# EAGLE schematic board_0.2v (EAGLE 7.7.0)
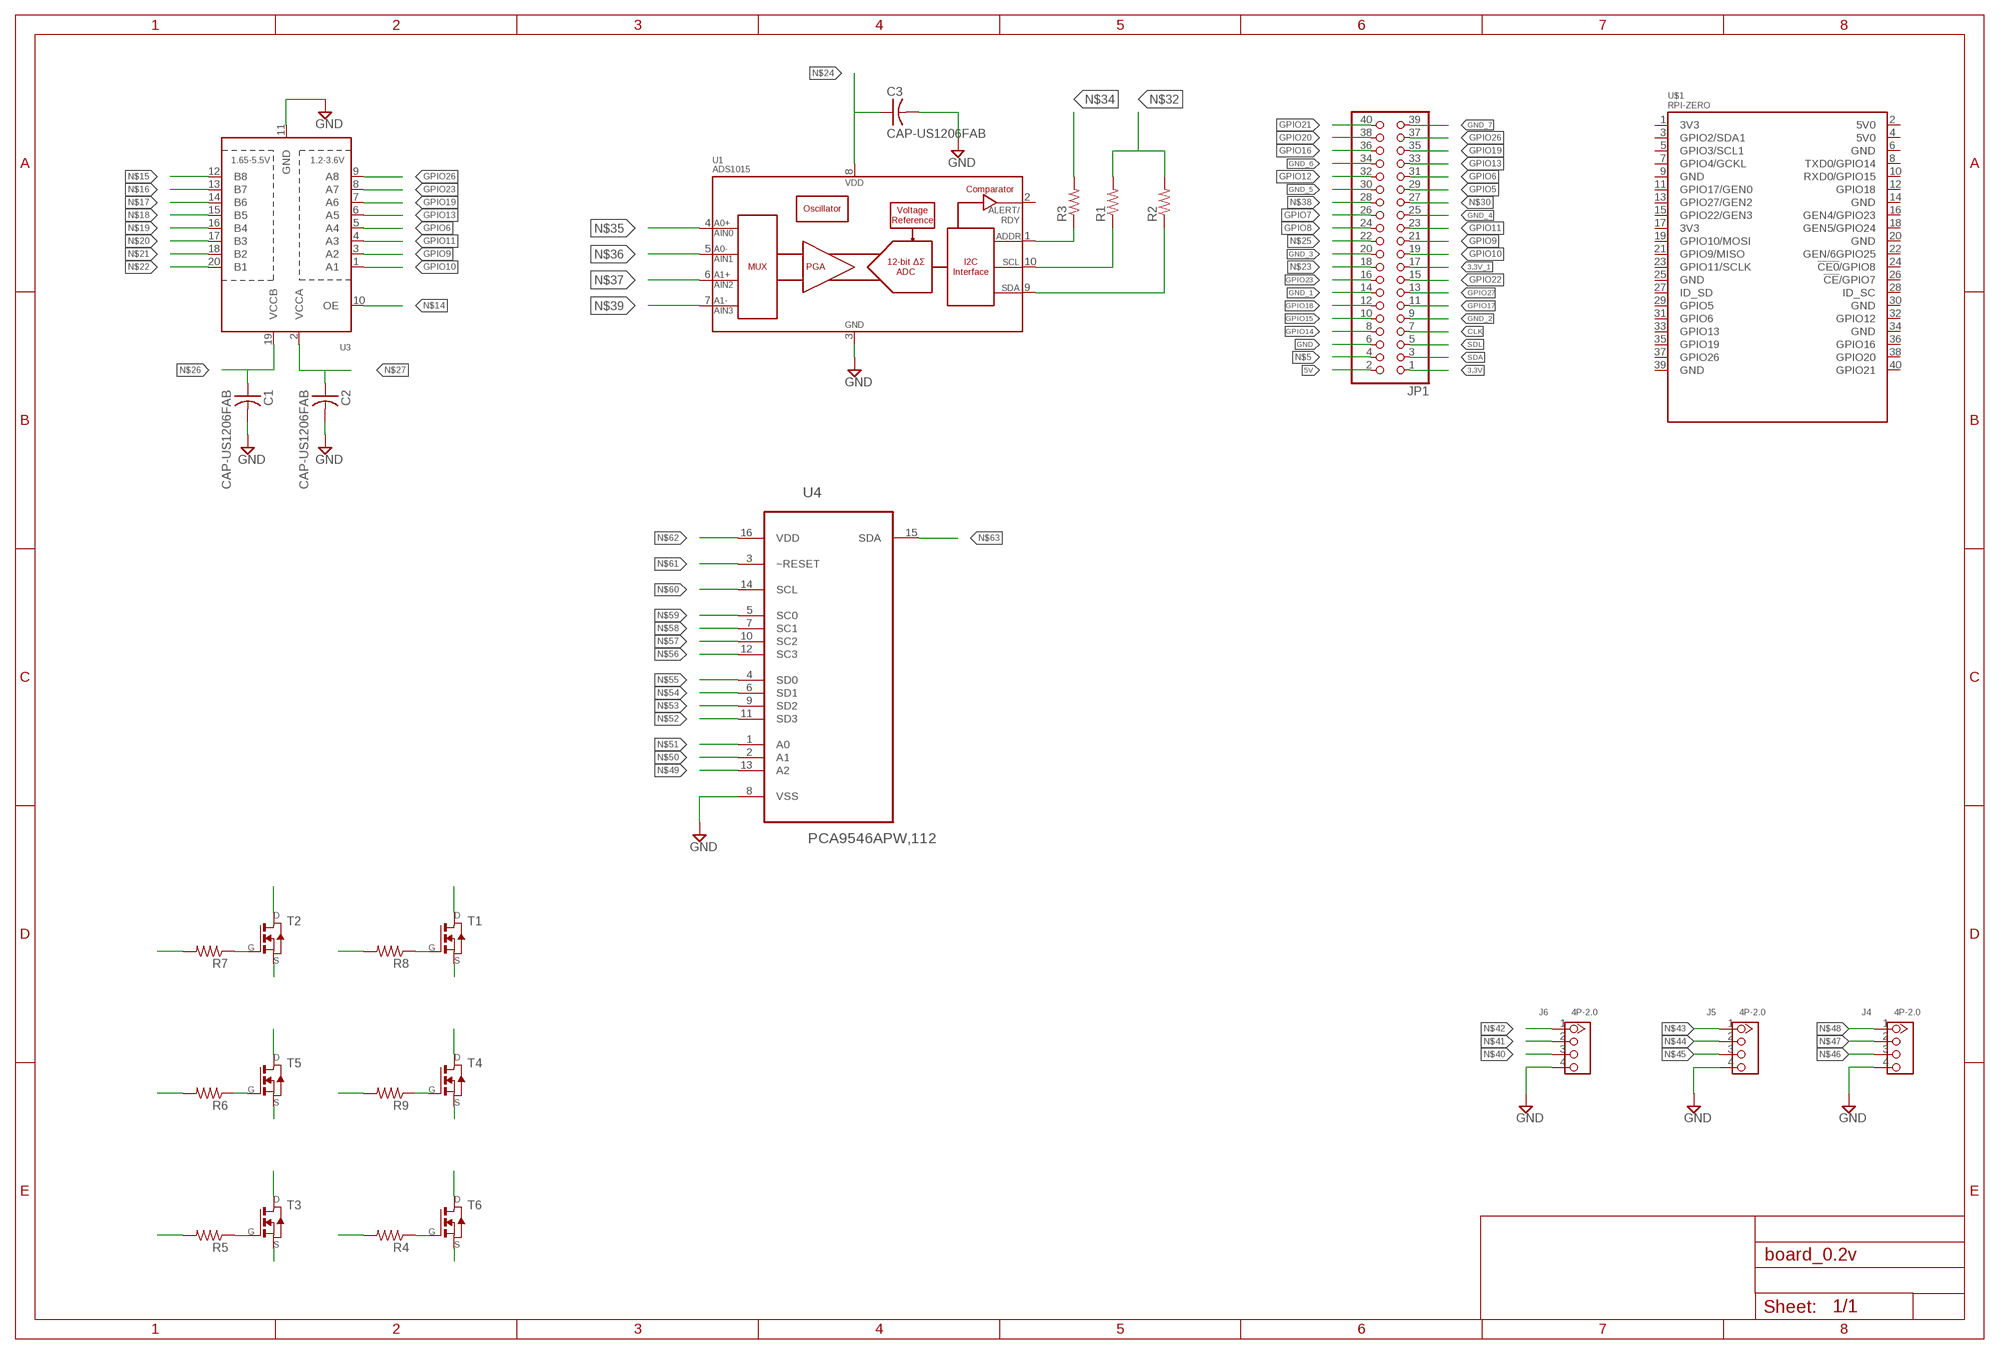
[diagram p0: schematic, sheet 1]

## Parts
C1  CAP-US1206FAB  [C1206FAB]
C2  CAP-US1206FAB  [C1206FAB]
C3  CAP-US1206FAB  [C1206FAB]
J4  4P-2.0  GROVE-CONNECTOR-DIP(4P-2.0)  [HW4-2.0]
J5  4P-2.0  GROVE-CONNECTOR-DIP(4P-2.0)  [HW4-2.0]
J6  4P-2.0  GROVE-CONNECTOR-DIP(4P-2.0)  [HW4-2.0]
JP1  PINHD-2X20  [2X20]
R1  RES-US1206FAB  [R1206FAB]
R2  RES-US1206FAB  [R1206FAB]
R3  RES-US1206FAB  [R1206FAB]
R4  RES-US1206FAB  [R1206FAB]
R5  RES-US1206FAB  [R1206FAB]
R6  RES-US1206FAB  [R1206FAB]
R7  RES-US1206FAB  [R1206FAB]
R8  RES-US1206FAB  [R1206FAB]
R9  RES-US1206FAB  [R1206FAB]
T1  NMOSFETTO252  [TO252]
T2  NMOSFETTO252  [TO252]
T3  NMOSFETTO252  [TO252]
T4  NMOSFETTO252  [TO252]
T5  NMOSFETTO252  [TO252]
T6  NMOSFETTO252  [TO252]
U1  ADS1015  [MSOP10]
U3  TXB0108PWR  [TSSOP20]
U4  PCA9546APW,112  [SOP65P640X110-16N]
U$1  RPI-ZERO  [RASPBERRYPI_BASTELSTUBE_V13_RASPI_BOARD_B+_FULL]

## Nets
3,3V: JP1.1
3,3V_1: JP1.17
5V: JP1.2
CLK: JP1.7
GND: C1.2 C2.2 C3.2 J4.4 J5.4 J6.4 JP1.6 U1.3(VSS) U3.11(GND) U4.8(VSS)
GND_1: JP1.14
GND_2: JP1.9
GND_3: JP1.20
GND_4: JP1.25
GND_5: JP1.30
GND_6: JP1.34
GND_7: JP1.39
GPIO5: JP1.29
GPIO6: JP1.31 U3.5(A4)
GPIO7: JP1.26
GPIO8: JP1.24
GPIO9: JP1.21 U3.3(A2)
GPIO10: JP1.19 U3.1(A1)
GPIO11: JP1.23 U3.4(A3)
GPIO12: JP1.32
GPIO13: JP1.33 U3.6(A5)
GPIO14: JP1.8
GPIO15: JP1.10
GPIO16: JP1.36
GPIO17: JP1.11
GPIO18: JP1.12
GPIO19: JP1.35 U3.7(A6)
GPIO20: JP1.38
GPIO21: JP1.40
GPIO22: JP1.15
GPIO23: JP1.16 U3.8(A7)
GPIO26: JP1.37 U3.9(A8)
GPIO27: JP1.13
N$5: JP1.4
N$14: U3.10(OE)
N$15: U3.12(B8)
N$16: U3.13(B7)
N$17: U3.14(B6)
N$18: U3.15(B5)
N$19: U3.16(B4)
N$20: U3.17(B3)
N$21: U3.18(B2)
N$22: U3.20(B1)
N$23: JP1.18
N$24: C3.1 U1.8(VDD)
N$25: JP1.22
N$26: C1.1 U3.19(VCCB)
N$27: C2.1 U3.2(VCCA)
N$28: R7.1 T2.1(G)
N$29: R1.1 U1.10(SCL)
N$30: JP1.27
N$31: R2.1 U1.9(SDA)
N$32: R1.2 R2.2
N$33: R3.1 U1.1(ADDR)
N$34: R3.2
N$35: U1.4(AIN0)
N$36: U1.5(AIN1)
N$37: U1.6(AIN2)
N$38: JP1.28
N$39: U1.7(AIN3)
N$40: J6.3
N$41: J6.2
N$42: J6.1
N$43: J5.1
N$44: J5.2
N$45: J5.3
N$46: J4.3
N$47: J4.2
N$48: J4.1
N$49: U4.13(A2)
N$50: U4.2(A1)
N$51: U4.1(A0)
N$52: U4.11(SD3)
N$53: U4.9(SD2)
N$54: U4.6(SD1)
N$55: U4.4(SD0)
N$56: U4.12(SC3)
N$57: U4.10(SC2)
N$58: U4.7(SC1)
N$59: U4.5(SC0)
N$60: U4.14(SCL)
N$61: U4.3(~RESET)
N$62: U4.16(VDD)
N$63: U4.15(SDA)
N$64: R6.1 T5.1(G)
N$65: R8.1 T1.1(G)
N$66: R9.1 T4.1(G)
N$67: R5.1 T3.1(G)
N$68: R4.1 T6.1(G)
N$69: R5.2
N$70: R6.2
N$71: R7.2
N$72: R8.2
N$73: R9.2
N$74: R4.2
N$75: T2.3(D)
N$76: T2.2(S)
N$77: T1.3(D)
N$78: T1.2(S)
N$79: T5.2(S)
N$80: T4.2(S)
N$81: T3.2(S)
N$82: T6.2(S)
N$83: T3.3(D)
N$84: T6.3(D)
N$85: T5.3(D)
N$86: T4.3(D)
SDA: JP1.3
SDL: JP1.5
Unconnected: U1.2(ALERT/RDY) U$1.1(3V3) U$1.2(5V0) U$1.3(GPIO2/SDA1) U$1.4(5V0) U$1.5(GPIO3/SCL1) U$1.6(GND) U$1.7(GPIO4/GCKL) U$1.8(TXD0/GPIO14) U$1.9(GND) U$1.10(RXD0/GPIO15) U$1.11(GPIO17/GEN0) U$1.12(GPIO18) U$1.13(GPIO27/GEN2) U$1.14(GND) U$1.15(GPIO22/GEN3) U$1.16(GEN4/GPIO23) U$1.17(3V3) U$1.18(GEN5/GPIO24) U$1.19(GPIO10/MOSI) U$1.20(GND) U$1.21(GPIO9/MISO) U$1.22(GEN/6GPIO25) U$1.23(GPIO11/SCLK) U$1.24(!CE0!/GPIO8) U$1.25(GND) U$1.26(!CE!/GPIO7) U$1.27(ID_SD) U$1.28(ID_SC) U$1.29(GPIO5) U$1.30(GND) U$1.31(GPIO6) U$1.32(GPIO12) U$1.33(GPIO13) U$1.34(GND) U$1.35(GPIO19) U$1.36(GPIO16) U$1.37(GPIO26) U$1.38(GPIO20) U$1.39(GND) U$1.40(GPIO21)

## Library data of the parts
C1-C3 = fab:CAP-US
J4-J6 = Seeed-OPL-Connector:GROVE-CONNECTOR-DIP(4P-2.0): 320110033
JP1 = adafruit:PINHD-2X20: PIN HEADER
R1-R9 = fab:RES-US: Resistor (US Symbol) Variants with postfix FAB are widened to allow the routing of internal traces
T1-T6 = fab_2:NMOSFET: MOS FET
U1 = SparkFun-IC-Conversion:ADS1015: ADS1015 12-BIT ADC 12-Bit Del-Sig ADC Four single-ended inputs or two differential inputs Internal PGA I2C interface 2.0-5.5V SparkFun Products SparkFun Block for Intel Edison - ADC <https://www.sparkfun.com/products/13770> (DEV-13770); PROD_ID: IC-12270
U3 = adafruit:TXB0108PWR: 8-Bit Bi-Directional Level Shifter 1.2V-3.6V (VCCA) to 1.65V-5.5V (VCCB) bi-directional level shifter with auto direction sensing. Max data rate - VCCA 1.8V: 20Mbps (50ns), VCCA 3.3V: 100Mbps (10ns) Digikey: 296-21527-1-ND
U4 = NXP_By_element14_Batch_1:PCA9546APW,112: 4-channel I2C-bus switch with reset; MPN: PCA9546APW,112; OC_FARNELL: 1831208; OC_NEWARK: 70R6610; PACKAGE: TSSOP-16; SUPPLIER: NXP
U$1 = RPI-Zero:RPI-ZERO